# EAGLE design openSX70-dongle_SEEED_v52-V (EAGLE 9.2.0)
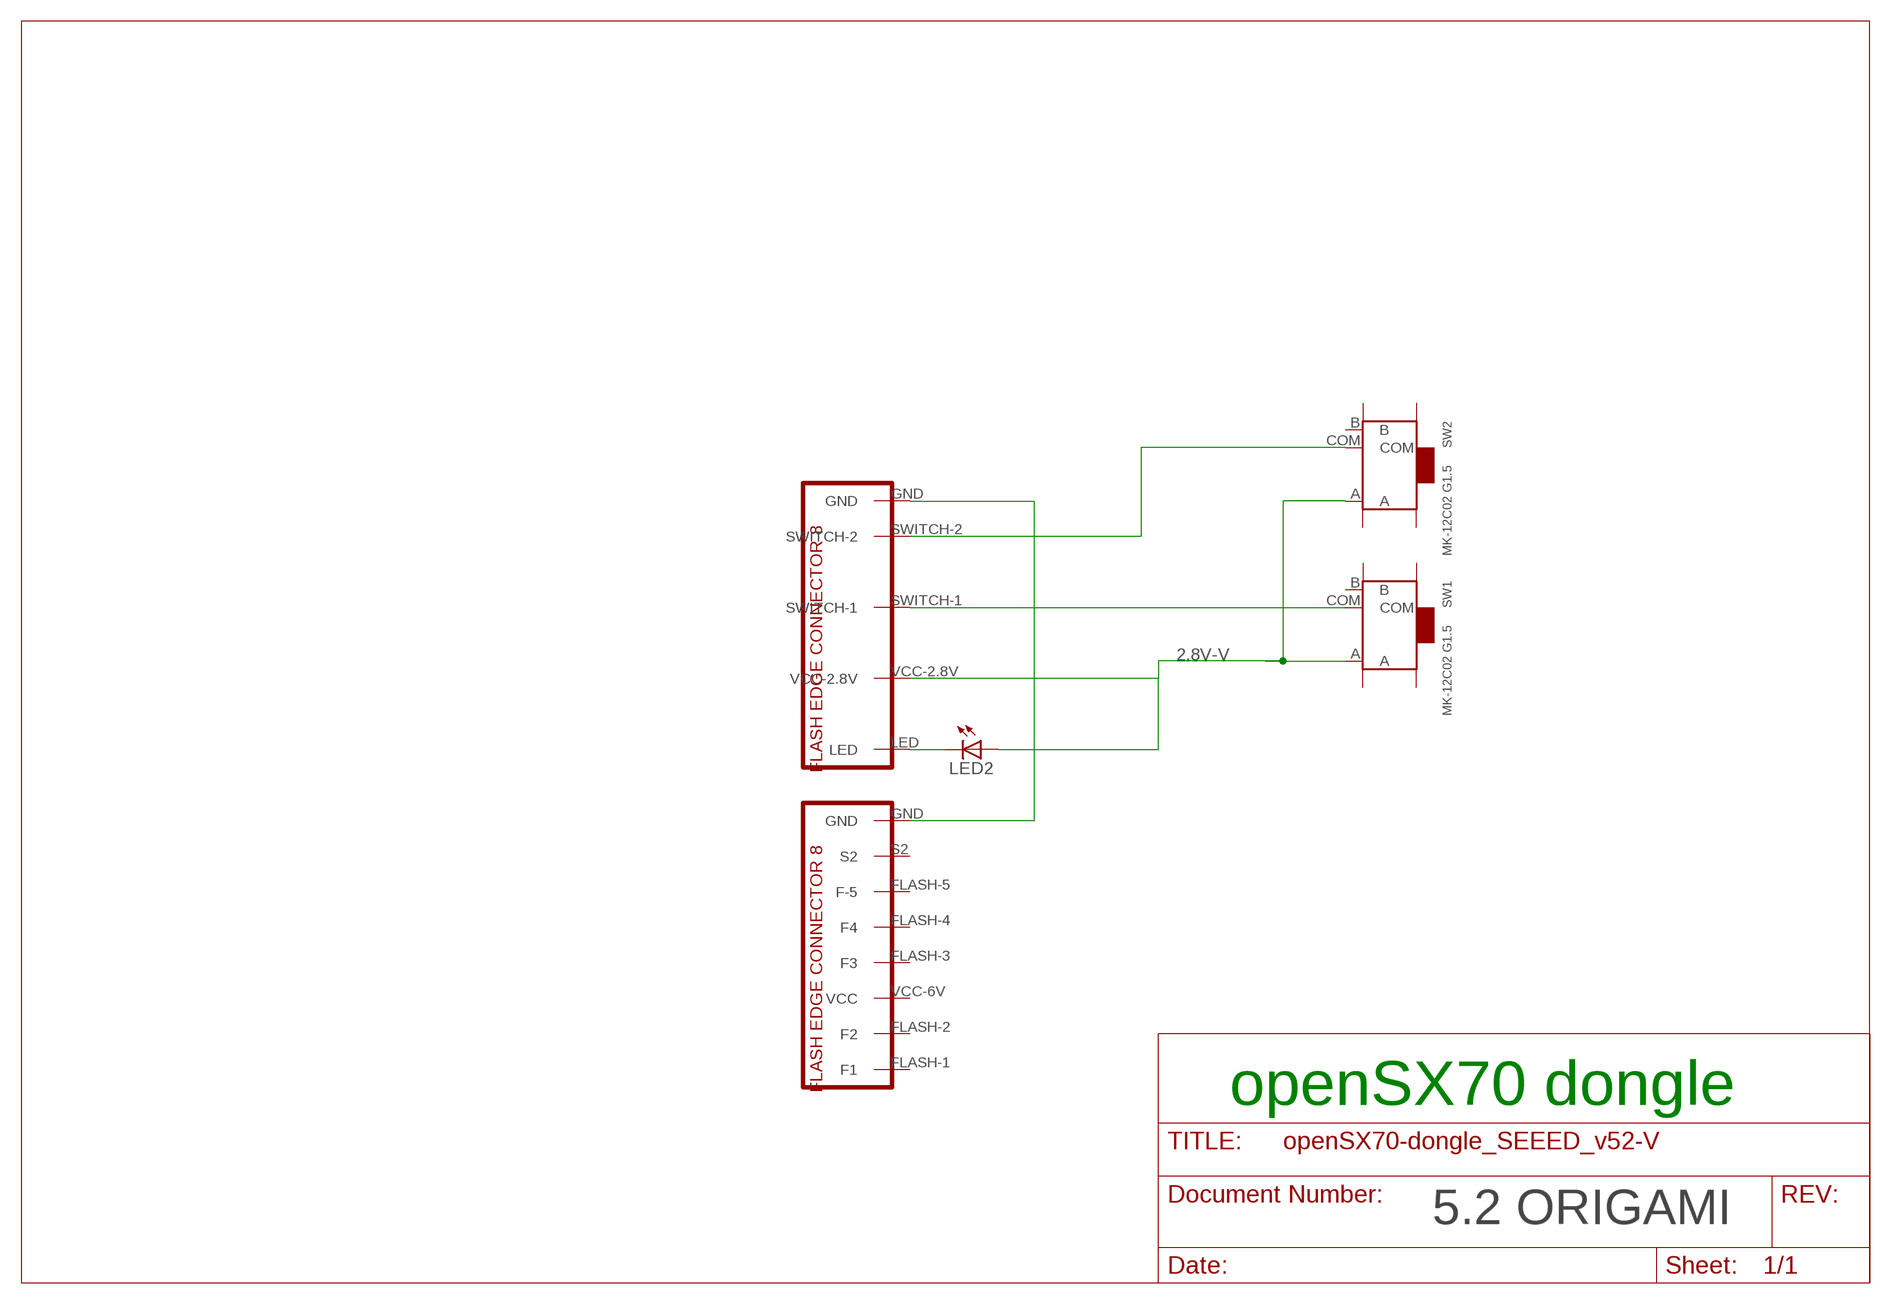
[diagram p0: schematic, sheet 1]

## Parts
LED2  LEDCHIP-LED0805  [CHIP-LED0805]
SW1  MK-12C02 G1.5  SMD-TOGGLE-SWITCH-ON-ON(3+4P-6.7X2.7MM)  [SW7-SMD-L6.7X2.7X3.2MM]
SW2  MK-12C02 G1.5  SMD-TOGGLE-SWITCH-ON-ON(3+4P-6.7X2.7MM)  [SW7-SMD-L6.7X2.7X3.2MM]
U$1  FLASH-BRIDGE-SW1-SW2-LED-SMALL  [FLASH-8-BRIDGE-SW1-SW2-LED-SMALL]
U$2  SX70-FLASH-EDGE8-MALE-LONG  [SX70-FLASH-EDGE8-2]

## Nets
2.8V-V: LED2.A SW1.A SW2.A U$1.VCC-2.8V
N$1: U$1.GND U$2.GND
N$2: SW1.COM U$1.SWITCH-1
N$3: SW2.COM U$1.SWITCH-2
N$4: LED2.C U$1.LED
Unconnected: SW1.B SW1.SS1 SW1.SS2 SW1.SS3 SW1.SS4 SW2.B SW2.SS1 SW2.SS2 SW2.SS3 SW2.SS4 U$2.FLASH-1(F1) U$2.FLASH-2(F2) U$2.FLASH-3(F3) U$2.FLASH-4(F4) U$2.FLASH-5(F-5) U$2.S2 U$2.VCC-6V(VCC)

## Notes on the sheet
- openSX70 dongle
- 5.2 ORIGAMI

## Library data of the parts
LED2 = led:LED: LED OSRAM: - CHIPLED LG R971, LG N971, LY N971, LG Q971, LY Q971, LO R971, LY R971 LH N974, LH R974 LS Q976, LO Q976, LY Q976 LO Q996 - Hyper CHIPLED LW Q18S LB Q993, LB Q99A, LB R99A - SideLED LS A670, LO A670, LY A670, LG A670, LP A670 LB A673, LV A673, LT A673, LW A673 LH A674 LY A675 LS A676, LA A676, LO A676, LY A676, LW A676 LS A679, LY A679, LG A679 - Hyper Micro SIDELED® LS Y876, LA Y876, LO Y876, LY Y876 LT Y87S - SmartLED LW L88C, LW L88S LB L89C, LB L89S, LG L890 LS L89K, LO L89K, LY L89K LS L896, LA L896, LO L896, LY L896 - TOPLED LS T670, LO T670, LY T670, LG T670, LP T670 LSG T670, LSP T670, LSY T670, LOP T670, LYG T670 LG T671, LOG T671, LSG T671 LB T673, LV T673, LT T673, LW T673 LH T674 LS T676, LA T676, LO T676, LY T676, LB T676, LH T676, LSB T676, LW T676 LB T67C, LV T67C, LT T67C, LS T67K, LO T67K, LY T67K, LW E67C LS E67B, LA E67B, LO E67B, LY E67B, LB E67C, LV E67C, LT E67C LW T67C LS T679, LY T679, LG T679 LS T770, LO T770, LY T770, LG T770, LP T770 LB T773, LV T773, LT T773, LW T773 LH T774 LS E675, LA E675, LY E675, LS T675 LS T776, LA T776, LO T776, LY T776, LB T776 LHGB T686 LT T68C, LB T68C - Hyper Mini TOPLED® LB M676 - Mini TOPLED Santana® LG M470 LS M47K, LO M47K, LY M47K Source: http://www.osram.convergy.de LUXEON: - LUMILED® LXK2-PW12-R00, LXK2-PW12-S00, LXK2-PW14-U00, LXK2-PW14-V00 LXK2-PM12-R00, LXK2-PM12-S00, LXK2-PM14-U00 LXK2-PE12-Q00, LXK2-PE12-R00, LXK2-PE12-S00, LXK2-PE14-T00, LXK2-PE14-U00 LXK2-PB12-K00, LXK2-PB12-L00, LXK2-PB12-M00, LXK2-PB14-N00, LXK2-PB14-P00, LXK2-PB14-Q00 LXK2-PR12-L00, LXK2-PR12-M00, LXK2-PR14-Q00, LXK2-PR14-R00 LXK2-PD12-Q00, LXK2-PD12-R00, LXK2-PD12-S00 LXK2-PH12-R00, LXK2-PH12-S00 LXK2-PL12-P00, LXK2-PL12-Q00, LXK2-PL12-R00 Source: www.luxeon.com KINGBRIGHT: KA-3528ASYC Source: www.kingbright.com
SW1 SW2 = Seeed-Switch:SMD-TOGGLE-SWITCH-ON-ON(3+4P-6.7X2.7MM): 311030001; MPN: MK-12C02 G1.5
U$1 = _openSX70:FLASH-BRIDGE-SW1-SW2-LED-SMALL
U$2 = _openSX70:SX70-FLASH-EDGE8-MALE-LONG

## Net classes
0 GND: width 0.305 mm
1 VCC: width 0.254 mm
2 2.8V: width 0.254 mm

## Board
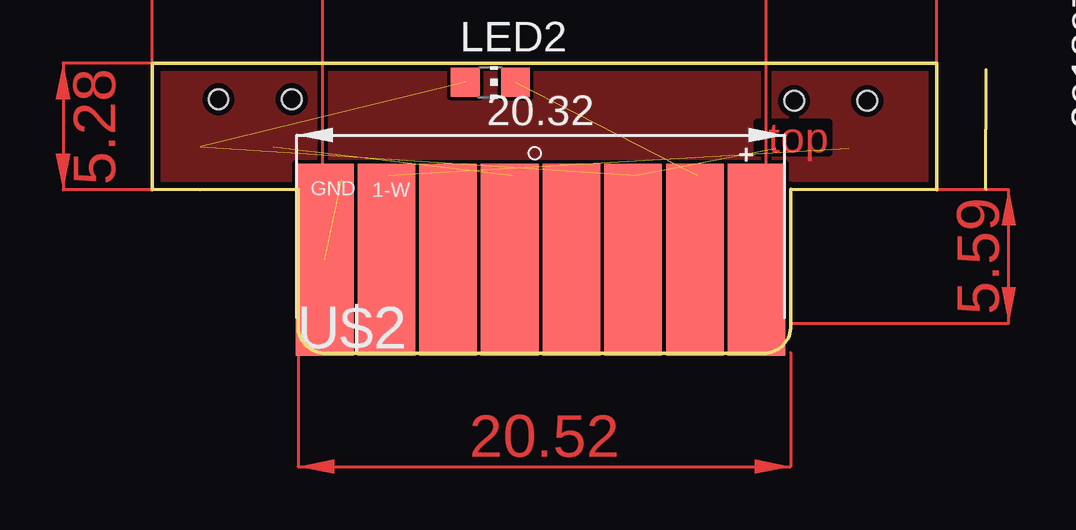
[diagram p1: board, top side]
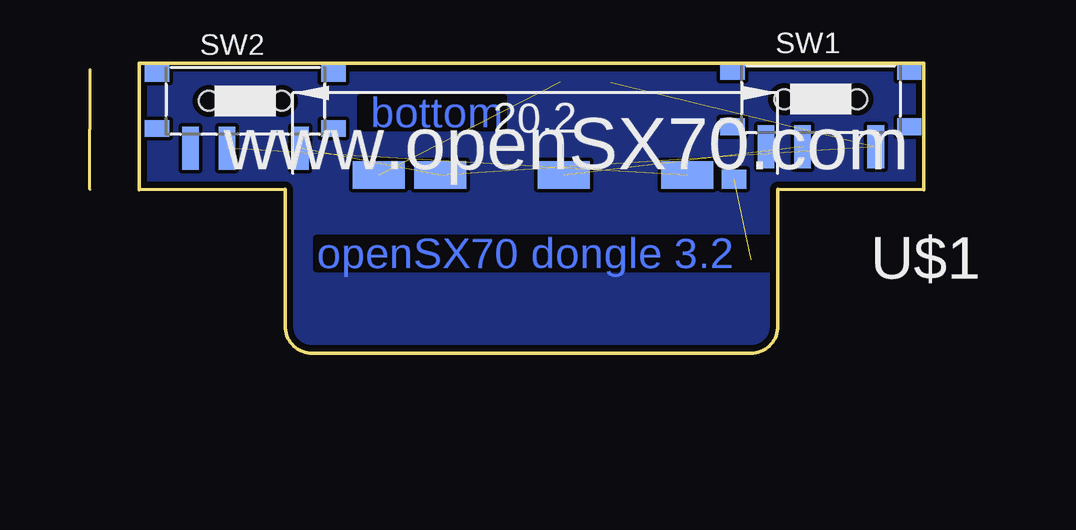
[diagram p2: board, bottom side, seen from below]

Size 32.69 x 12.09 mm. Coordinates in mm from the lower left corner, seen from the top.
Outline: 26.63,6.71 26.61,6.83
Outline: 26.61,6.83 26.61,1.24 arc-90 25.59,0 7.1,0 arc-90 6.08,1.24 6.08,6.83 0,6.81 0,12.09 32.69,12.09 32.69,6.81 26.61,6.83
Copper layers (1*16): Top 0.035mm / dielectric 1.5mm / Bottom 0.035mm
Design rules "SeeedStudio_2layer_DRU_no_angle_20140221": minimum track width 6mil, minimum drill 12mil, track to track 6mil, track to pad 6mil, pad to pad 6mil, via to via 6mil, smd to smd 0mil, copper to edge 10mil, drill to drill 10mil, minimum pad ring 10mil, minimum via ring 6mil, stop-mask expansion 2mil, vias tented up to drill 100mil, thermal gap 10mil

### Footprints (pad centres in the part's own frame; a part is rotated, then mirrored left to right if it is on the bottom)
CHIP-LED0805 = smd 1.2 x 1.2: A 0,-1.05; C 0,1.05
SW7-SMD-L6.7X2.7X3.2MM = smd 1.8 x 0.7: A 1.978,2.286; B 1.978,-2.286; COM 1.978,-0.762 | smd 0.7 x 1.016: SS1 -1.15,-3.683; SS2 1.15,-3.683; SS3 1.15,3.683; SS4 -1.15,3.683 | hole 0.813: 0,-1.524; 0,1.524
FLASH-8-BRIDGE-SW1-SW2-LED-SMALL = smd 1.016 x 0.8: GND -8.39,5.138 | smd 2.159 x 1.143: LED 6.42,4.96; SWITCH-1 -1.29,4.96; SWITCH-2 -6.43,4.96; VCC-2.8V 3.85,4.96
SX70-FLASH-EDGE8-2 = smd 2.4 x 8: FLASH-1 8.99,7.5; FLASH-2 6.42,7.5; FLASH-3 1.28,7.5; FLASH-4 -1.29,7.5; FLASH-5 -3.86,7.5; GND -9,7.5; S2 -6.43,7.5; VCC-6V 3.85,7.5

### Placement (x,y rotation side)
LED2  14.09,11.29 270 top
SW1  4.29,10.59 270 bottom
SW2  28.27,10.52 270 bottom
U$1  16.29,12.39 180 bottom
U$2  16.19,-3.61 0 top

### Tracks (layer width: path | path; a pad name or v marks a point on that pad's centre or on a via)
2.8V-V  (3 unrouted)
GND
  pour Top: -0.11,12.08 32.65,12.14 32.65,6.86 -0.11,6.8
  pour Bottom: -0.01,12.09 -0.01,6.81 5.93,6.81 5.93,0.36 26.45,0.36 26.45,6.81 32.73,6.72 32.73,12.03
N$1  (1 unrouted)
N$2  (1 unrouted)
N$3  (1 unrouted)
N$4  (1 unrouted)
(copper drawn outside any net)
  shapes: Top area x5

### Text on the board
Top: top
Bottom: bottom | openSX70 dongle 3.2
tPlace: 20180707_V5 | + | +
bPlace: www.openSX70.com
tNames: GND | 1-W
bNames: OPTION / SELECTOR | S2 | S1